# Altium schematic sheet Course Design.SchDoc
size A4; SheetNumber: 1; SheetTotal: 1
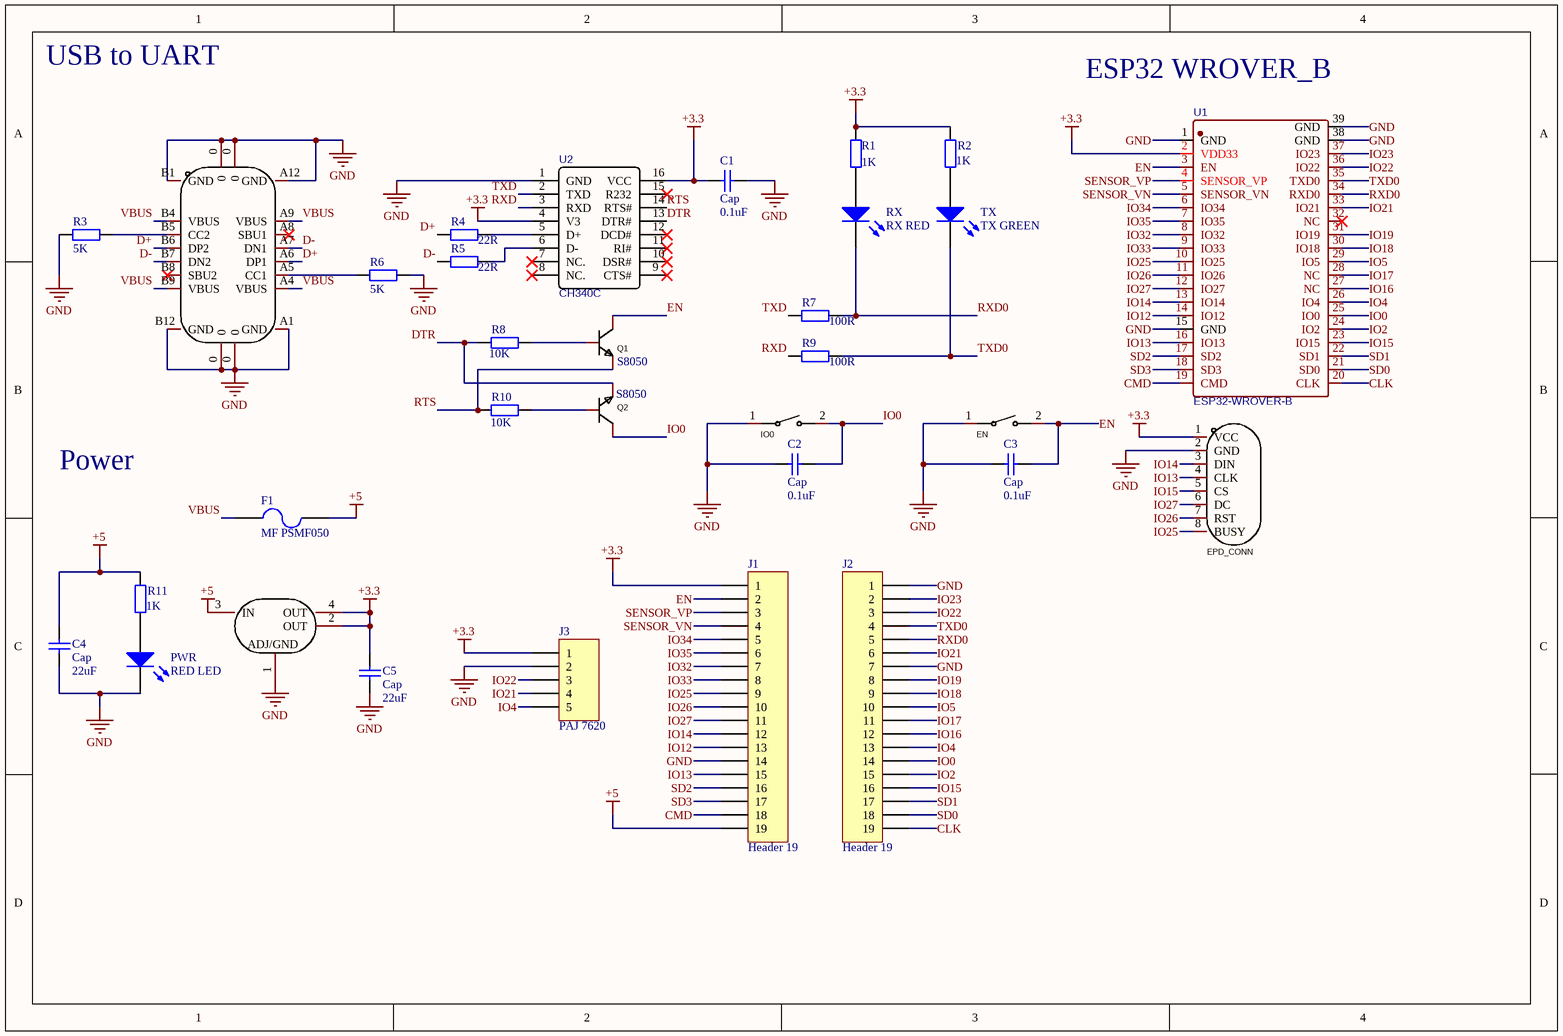
[diagram p0: Course Design.SchDoc]

## Parts
C1  Cap  value 0.1uF  [0805C]
C2  Cap  value 0.1uF  [0805C]
C3  Cap  value 0.1uF  [0805C]
C4  Cap  value 22uF  [1206C]
C5  Cap  value 22uF  [1206C]
EN  K2-1107ST-A4DW-06_C118141  [KEY-SMD_L6.2-W3.6-LS8.0]  (value not drawn)
EPD_CONN  X2012WV-08-N0SN  [CONN-TH_X2012WV-08-N0SN]  (value not drawn)
F1  MF PSMF050  [0805]
IO0  K2-1107ST-A4DW-06_C118141  [KEY-SMD_L6.2-W3.6-LS8.0]  (value not drawn)
J1  Header 19  [HDR1X19]
J2  Header 19  [HDR1X19]
J3  PAJ 7620  [PAJ7620]
PWR  RED LED  [0805D]
Q1  S8050  [SOT23_N]
Q2  S8050  [SOT23_N]
R1  value 1K  [0805R]  (hidden comment: Res2)
R2  value 1K  [0805R]  (hidden comment: Res2)
R3  value 5K  [0805R]  (hidden comment: Res2)
R4  value 22R  [0805R]  (hidden comment: Res2)
R5  value 22R  [0805R]  (hidden comment: Res2)
R6  value 5K  [0805R]  (hidden comment: Res2)
R7  value 100R  [0805R]  (hidden comment: Res2)
R8  value 10K  [0805R]  (hidden comment: Res2)
R9  value 100R  [0805R]  (hidden comment: Res2)
R10  value 10K  [0805R]  (hidden comment: Res2)
R11  value 1K  [0805R]  (hidden comment: Res2)
RX  RX RED  [0805D]
TX  TX GREEN  [0805D]
U1  ESP32-WROVER-B  [ESP32 WROVER B]
U2  CH340C  [SOP-16_L10.0]
U3  AMS1117-3.3_C2992570  [SOT223_N]  (value not drawn)
USBC1  TYPE-C-31-M-12  [USB-C_SMD]  (value not drawn)

## Nets
+3.3: C1.1 C5.2 EPD_CONN.1(VCC) J1.1 J3.1 R1.2 R2.2 U1.2(VDD33) U2.4(V3) U2.16(VCC) U3.2(OUT) U3.4(OUT)
+5: C4.2 F1.2 J1.19 R11.2 U3.3(IN)
GND: C1.2 C2.1 C3.1 C4.1 C5.1 EN.1 EPD_CONN.2(GND) IO0.1 J1.14 J2.1 J2.7 J3.2 PWR.2(K) R3.1 R6.2 U1.1(GND) U1.15(GND) U1.38(GND) U1.39(GND) U2.1(GND) U3.1(ADJ/GND) USBC1.0 USBC1.A1(GND) USBC1.A12(GND) USBC1.B1(GND) USBC1.B12(GND)
CLK: J2.19 U1.20(CLK)
CMD: J1.18 U1.19(CMD)
D+: R4.1 USBC1.A6(DP1) USBC1.B6(DP2)
D-: R5.1 USBC1.A7(DN1) USBC1.B7(DN2)
DTR: Q2.2(E) R8.1 U2.13(DTR#)
EN: C3.2 EN.2 J1.2 Q1.3(C) U1.3(EN)
IO0: C2.2 IO0.2 J2.14 Q2.3(C) U1.25(IO0)
IO2: J2.15 U1.24(IO2)
IO4: J2.13 J3.5 U1.26(IO4)
IO5: J2.10 U1.29(IO5)
IO12: J1.13 U1.14(IO12)
IO13: EPD_CONN.4(CLK) J1.15 U1.16(IO13)
IO14: EPD_CONN.3(DIN) J1.12 U1.13(IO14)
IO15: EPD_CONN.5(CS) J2.16 U1.23(IO15)
IO16: J2.12 U1.27(NC)
IO17: J2.11 U1.28(NC)
IO18: J2.9 U1.30(IO18)
IO19: J2.8 U1.31(IO19)
IO21: J2.6 J3.4 U1.33(IO21)
IO22: J2.3 J3.3 U1.36(IO22)
IO23: J2.2 U1.37(IO23)
IO25: EPD_CONN.8(BUSY) J1.9 U1.10(IO25)
IO26: EPD_CONN.7(RST) J1.10 U1.11(IO26)
IO27: EPD_CONN.6(DC) J1.11 U1.12(IO27)
IO32: J1.7 U1.8(IO32)
IO33: J1.8 U1.9(IO33)
IO34: J1.5 U1.6(IO34)
IO35: J1.6 U1.7(IO35)
RTS: Q1.2(E) R10.1 U2.14(RTS#)
RXD: R9.1 U2.3(RXD)
RXD0: J2.5 R7.2 RX.2(K) U1.34(RXD0)
SD0: J2.18 U1.21(SD0)
SD1: J2.17 U1.22(SD1)
SD2: J1.16 U1.17(SD2)
SD3: J1.17 U1.18(SD3)
SENSOR_VN: J1.4 U1.5(SENSOR_VN)
SENSOR_VP: J1.3 U1.4(SENSOR_VP)
TXD: R7.1 U2.2(TXD)
TXD0: J2.4 R9.2 TX.2(K) U1.35(TXD0)
VBUS: F1.1 USBC1.A4(VBUS) USBC1.A9(VBUS) USBC1.B4(VBUS) USBC1.B9(VBUS)
NetPWR_1: PWR.1(A) R11.1
NetQ1_1: Q1.1(B) R8.2
NetQ2_1: Q2.1(B) R10.2
NetR1_1: R1.1 RX.1(A)
NetR2_1: R2.1 TX.1(A)
NetR3_2: R3.2 USBC1.B5(CC2)
NetR4_2: R4.2 U2.5(D+)
NetR5_2: R5.2 U2.6(D-)
NetR6_1: R6.1 USBC1.A5(CC1)

Not connected (* = marked no-connect by the designer): U1 32(NC)*; U2 7(NC.)* 8(NC.)* 9(CTS#)* 10(DSR#)* 11(RI#)* 12(DCD#)* 15(R232)*; USBC1 A8(SBU1)* B8(SBU2)*

## Notes on the sheet
- USB to UART
- (near U1) ESP32 WROVER_B
- Power

## Library data of the parts
C1-C5 = Cap: Capacitor; Published: 8-Jun-2000; LatestRevisionDate: 17-Jul-2002; LatestRevisionNote: Re-released for DXP Platform.; PackageReference: RAD-0.3; Publisher: Altium Limited; PackageDescription: Radial Cap, Thru-Hole; 2 Leads; 0.3 in Pin Spacing
EN IO0 = K2-1107ST-A4DW-06_C118141: Manufacturer: 韩国韩荣; Symbol: K2-1107ST-A4SW-06; Add into BOM: yes; Contact Current: 50mA; Voltage Rating (DC): 12V; Insulation Resistance: 100MΩ; Circuit: 单刀单掷; Actuator Style: 矩形按钮; Operating Force: 250gf@±30gf; Mechanical Life: 100000; Switch Length: 6.1mm; Switch Width: 3.6mm; Switch Height: 2.5mm; Name: K2-1107ST-A4DW-06; Device: K2-1107ST-A4DW-06_C118141; LCSC Part Name: 轻触开关 3.6*6.1*2.5; Supplier Part: C118141; Manufacturer Part: K2-1107ST-A4DW-06; Supplier Footprint: SMD; JLCPCB Part Class: Extended Part; Datasheet: https://atta.szlcsc.com/upload/public/pdf/source/20210810/381712CEF248770C072B585C3485C888.pdf; Supplier: LCSC; Convert to PCB: yes; Mounting Style: 立贴; With Lamp: -; Operating Temperature: -25℃~+85℃
EPD_CONN = X2012WV-08-N0SN: Manufacturer: XKB Connectivity(中国星坤); Add into BOM: yes; Pitch: 2mm; Pins Structure: 1x8P; Number of PINs Per Row: 8; Gender: 母型插口; Welding Temperature (Max): 260℃; Name: X2012WV-08-N0SN; Symbol: X2012WV-08-N0SN; Device: X2012WV-08-N0SN; LCSC Part Name: 2mm 1x8P; Supplier Part: C571294; Manufacturer Part: X2012WV-08-N0SN; Supplier Footprint: 插件,P=2mm; JLCPCB Part Class: Extended Part; Datasheet: https://atta.szlcsc.com/upload/public/pdf/source/20211011/616CF97ACD7EE1DA4493F5FBA6803F08.pdf; Supplier: LCSC; Convert to PCB: yes; Reference Series: -; Number of Rows: 1; Row Spacing: -; Mounting Style: -; Contact Material: 黄铜; Contact Plating: 锡; Operating Temperature Range: -25℃~+85℃
F1 = Fuse 2: Fuse; Published: 8-Jun-2000; LatestRevisionDate: 17-Jul-2002; LatestRevisionNote: Re-released for DXP Platform.; PackageReference: PIN-W2/E2.8; Publisher: Altium Limited; PackageDescription: Thru-Hole; 2 Leads
J1 J2 = Header 19: Header, 19-Pin; LatestRevisionDate: 17-Jul-2002; LatestRevisionNote: Re-released for DXP Platform.; Publisher: Altium Limited
J3 = Header 5: Header, 5-Pin; LatestRevisionDate: 17-Jul-2002; LatestRevisionNote: Re-released for DXP Platform.; Publisher: Altium Limited
PWR RX TX = LED0: Typical INFRARED GaAs LED; Published: 8-Jun-2000; LatestRevisionDate: 08-Jul-2005; LatestRevisionNote: Mech Layer 1 removed.; PackageReference: LED-0; Publisher: Altium Limited; PackageDescription: LED; 2 Leads
Q1 Q2 = S8050: Manufacturer: Doeshare(德芯); Symbol: S8050_C2931719; Add into BOM: yes; Name: S8050; Device: S8050; LCSC Part Name: S8050; Supplier Part: C2931719; Manufacturer Part: S8050; Supplier Footprint: SOT-23; JLCPCB Part Class: Extended Part; Datasheet: https://atta.szlcsc.com/upload/public/pdf/source/20220117/E6D3315E0D6ADDB25840BFFAC039C5C0.pdf; Supplier: LCSC; Convert to PCB: yes
R1-R11 = Res2: Resistor; Published: 8-Jun-2000; LatestRevisionDate: 17-Jul-2002; LatestRevisionNote: Re-released for DXP Platform.; PackageReference: AXIAL-0.4; Publisher: Altium Limited; PackageDescription: Axial Device, Thru-Hole; 2 Leads; 0.4 in Pin Spacing
U1 = ESP32-WROVER-B: BOM_Manufacturer: Espressif Systems; Contributor: LCSC; BOM_Supplier: LCSC; BOM_Supplier Part: C503591; BOM_Manufacturer Part: ESP32-WROVER-B; BOM_JLCPCB Part Class: Extended Part; spicePre: U; spiceSymbolName: ESP32-WROVER-B
U2 = CH340C: BOM_Manufacturer: WCH; BOM_Supplier: LCSC; BOM_Manufacturer Part: CH340C; BOM_Supplier Part: C84681; BOM_JLCPCB Part Class: Extended Part; spicePre: U; spiceSymbolName: CH340C
U3 = AMS1117-3.3_C2992570: Manufacturer: 国芯佳品; Add into BOM: yes; Name: AMS1117-3.3; Symbol: AMS1117-3.3_C2992570; Device: AMS1117-3.3_C2992570; LCSC Part Name: AMS1117-3.3; Supplier Part: C2992570; Manufacturer Part: AMS1117-3.3; Supplier Footprint: SOT-223; JLCPCB Part Class: Extended Part; Datasheet: https://atta.szlcsc.com/upload/public/pdf/source/20220729/0D21C21EC310E4778671BF6BAE438640.pdf; Supplier: LCSC; Convert to PCB: yes
USBC1 = TYPE-C-31-M-12: Manufacturer: 韩国韩荣; Add into BOM: yes; Connector Type: Type-C; Gender: 母座; Number of Contacts: 16; Number of Ports: 1; Current Rating - Power (Max): 250mA; Name: TYPE-C-31-M-12; Symbol: TYPE-C-31-M-12; Device: TYPE-C-31-M-12; LCSC Part Name: TYPE-C-31-M-12; Supplier Part: C165948; Manufacturer Part: TYPE-C-31-M-12; Supplier Footprint: -; JLCPCB Part Class: Extended Part; Datasheet: https://atta.szlcsc.com/upload/public/pdf/source/20210111/C2682493_D8CCFED08835E878D16ACCF4460E43B8.pdf; Supplier: LCSC; Convert to PCB: yes; Standard: -